# Altium schematic sheet Fiducial Markers.SchDoc
size A
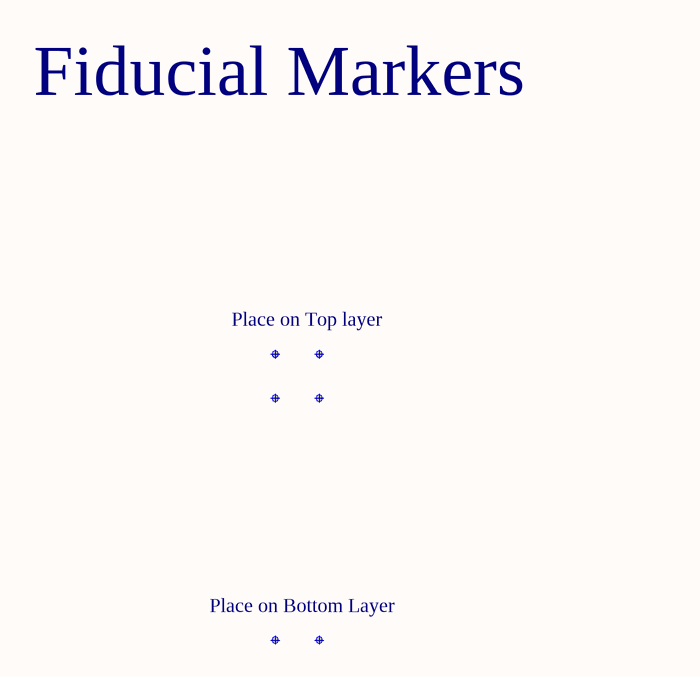
[diagram p0: Fiducial Markers.SchDoc]

## Parts
Fid1  Fiducial mark  [Fiducial_Round-Square]  (value not drawn)  (no BOM)
Fid2  Fiducial mark  [Fiducial_Round-Square]  (value not drawn)  (no BOM)
Fid3  Fiducial mark  [Fiducial_Round-Square]  (value not drawn)  (no BOM)
Fid4  Fiducial mark  [Fiducial_Round-Square]  (value not drawn)  (no BOM)
Fid5  Fiducial mark  [Fiducial_Round-Square]  (value not drawn)  (no BOM)
Fid6  Fiducial mark  [Fiducial_Round-Square]  (value not drawn)  (no BOM)

## Notes on the sheet
- Fiducial Markers
- Place on Top layer
- Place on Bottom Layer

## Library data of the parts
Fid1-Fid6 = Fiducial: Part Number: Fid-Mark-Round-Square; Artikkelnr Noca: N.A.; Manufacturer: *; Manufacturer Part Number: *; LatestRevisionDate: 2017-01-30; Pin Count: 1; Publisher: Nordic Semiconductor; Published: 2009-12-12; Value: *; Note: *; Footprint Doc: Fiducial; Part number IPS: N.A.; ComponentLink1URL: *; ComponentLink1Description: Datasheet; ComponentLink2URL: *; ComponentLink2Description: Supplier link; HelpURL: *; Supplier 1: *; Supplier Part Number 1: *; Supplier 2: *; Supplier Part Number 2: *